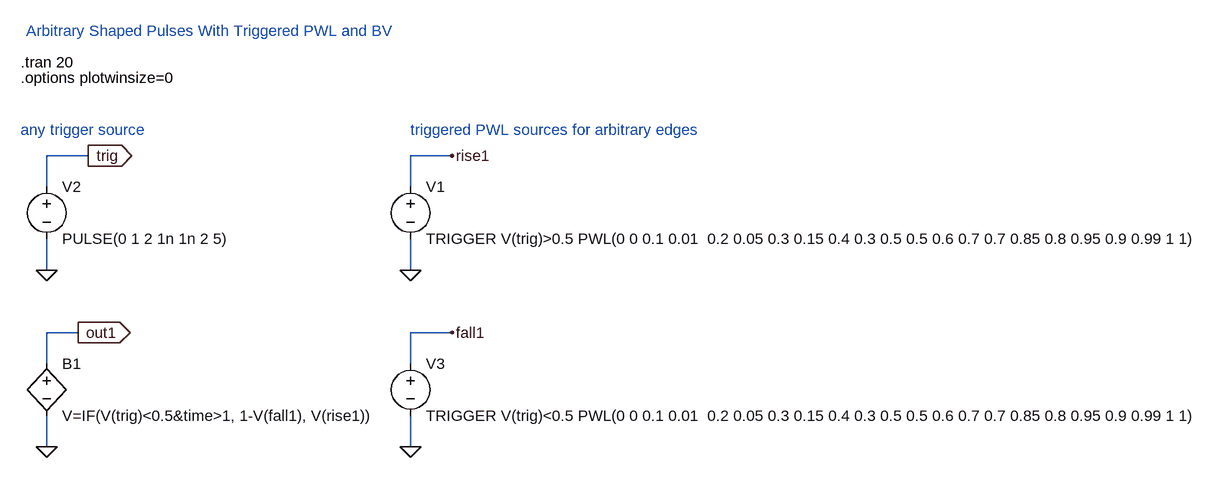
[diagram p0: schematic trigger_arb_edges.asc]
trigger_arb_edges.asc, the LTspice schematic file:
Version 4
SHEET 1 1844 680
WIRE -16 176 -80 176
WIRE 544 176 480 176
WIRE -80 224 -80 176
WIRE 480 224 480 176
WIRE -80 352 -80 304
WIRE 480 352 480 304
WIRE -32 448 -80 448
WIRE 544 448 480 448
WIRE -80 496 -80 448
WIRE 480 496 480 448
WIRE -80 624 -80 576
WIRE 480 624 480 576
FLAG 480 352 0
FLAG -80 352 0
FLAG 544 176 rise1
FLAG -16 176 trig
IOPIN -16 176 Out
FLAG 480 624 0
FLAG 544 448 fall1
FLAG -80 624 0
FLAG -32 448 out1
IOPIN -32 448 Out
SYMBOL voltage 480 208 R0
WINDOW 123 0 0 Left 0
WINDOW 39 0 0 Left 0
SYMATTR InstName V1
SYMATTR Value TRIGGER V(trig)>0.5 PWL(0 0 0.1 0.01  0.2 0.05 0.3 0.15 0.4 0.3 0.5 0.5 0.6 0.7 0.7 0.85 0.8 0.95 0.9 0.99 1 1)
SYMBOL voltage -80 208 R0
WINDOW 123 0 0 Left 0
WINDOW 39 0 0 Left 0
SYMATTR InstName V2
SYMATTR Value PULSE(0 1 2 1n 1n 2 5)
SYMBOL voltage 480 480 R0
WINDOW 123 0 0 Left 0
WINDOW 39 0 0 Left 0
SYMATTR InstName V3
SYMATTR Value TRIGGER V(trig)<0.5 PWL(0 0 0.1 0.01  0.2 0.05 0.3 0.15 0.4 0.3 0.5 0.5 0.6 0.7 0.7 0.85 0.8 0.95 0.9 0.99 1 1)
SYMBOL bv -80 480 R0
SYMATTR InstName B1
SYMATTR Value V=IF(V(trig)<0.5&time>1, 1-V(fall1), V(rise1))
TEXT -120 32 Left 0 !.tran 20
TEXT -112 -16 Left 0 ;Arbitrary Shaped Pulses With Triggered PWL and BV
TEXT -120 56 Left 0 !.options plotwinsize=0
TEXT 480 136 Left 0 ;triggered PWL sources for arbitrary edges
TEXT -120 136 Left 0 ;any trigger source

The netlist it stands for:
* trigger_arb_edges.asc
V1 rise1 0 TRIGGER V(trig)>0.5 PWL(0 0 0.1 0.01  0.2 0.05 0.3 0.15 0.4 0.3 0.5 0.5 0.6 0.7 0.7 0.85 0.8 0.95 0.9 0.99 1 1)
V2 trig 0 PULSE(0 1 2 1n 1n 2 5)
V3 fall1 0 TRIGGER V(trig)<0.5 PWL(0 0 0.1 0.01  0.2 0.05 0.3 0.15 0.4 0.3 0.5 0.5 0.6 0.7 0.7 0.85 0.8 0.95 0.9 0.99 1 1)
B1 out1 0 V=IF(V(trig)<0.5&time>1, 1-V(fall1), V(rise1))
.tran 20
* Arbitrary Shaped Pulses With Triggered PWL and BV
.options plotwinsize=0
* triggered PWL sources for arbitrary edges
* any trigger source
.backanno
.end